# Altium schematic sheet SpeakerWiring.SchDoc
size Tabloid
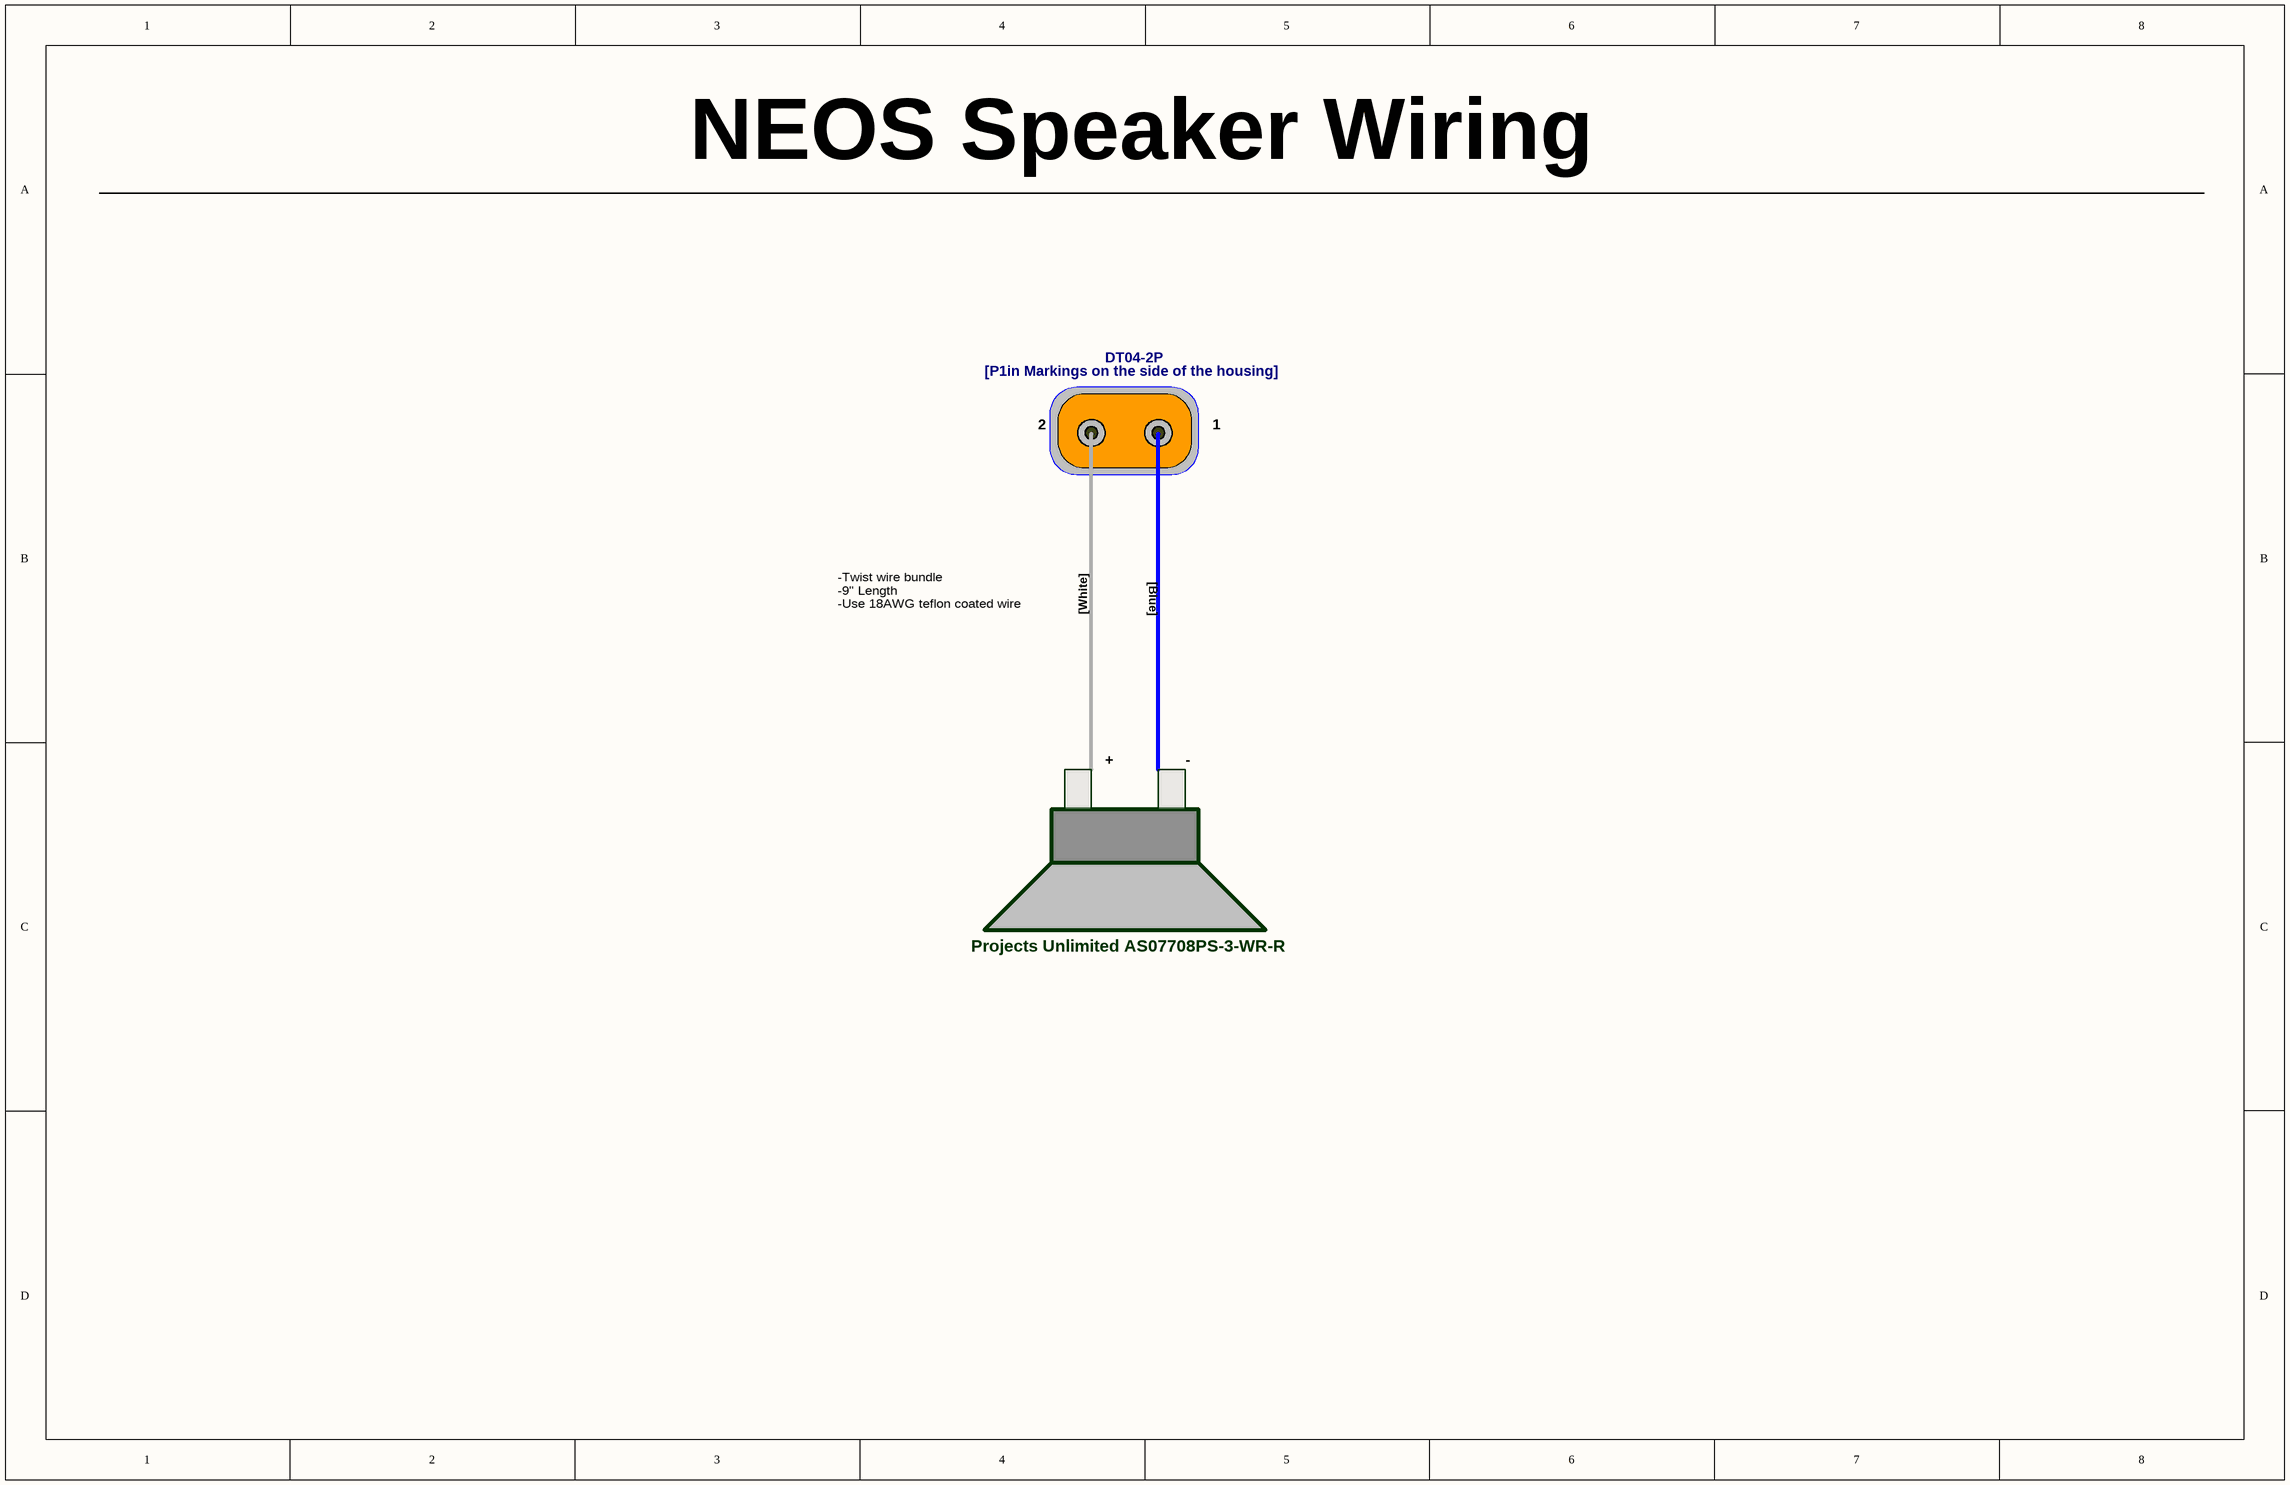
[diagram p0: SpeakerWiring.SchDoc]

## Notes on the sheet
- NEOS Speaker Wiring
- DT04-2P
- [P1in Markings on the side of the housing]
- 2
- 1
- -Twist wire bundle
  -9" Length
  -Use 18AWG teflon coated wire
- [White]
- [Blue]
- +
- -
- Projects Unlimited AS07708PS-3-WR-R